# EAGLE schematic i2c_relay (EAGLE 9.6.2)
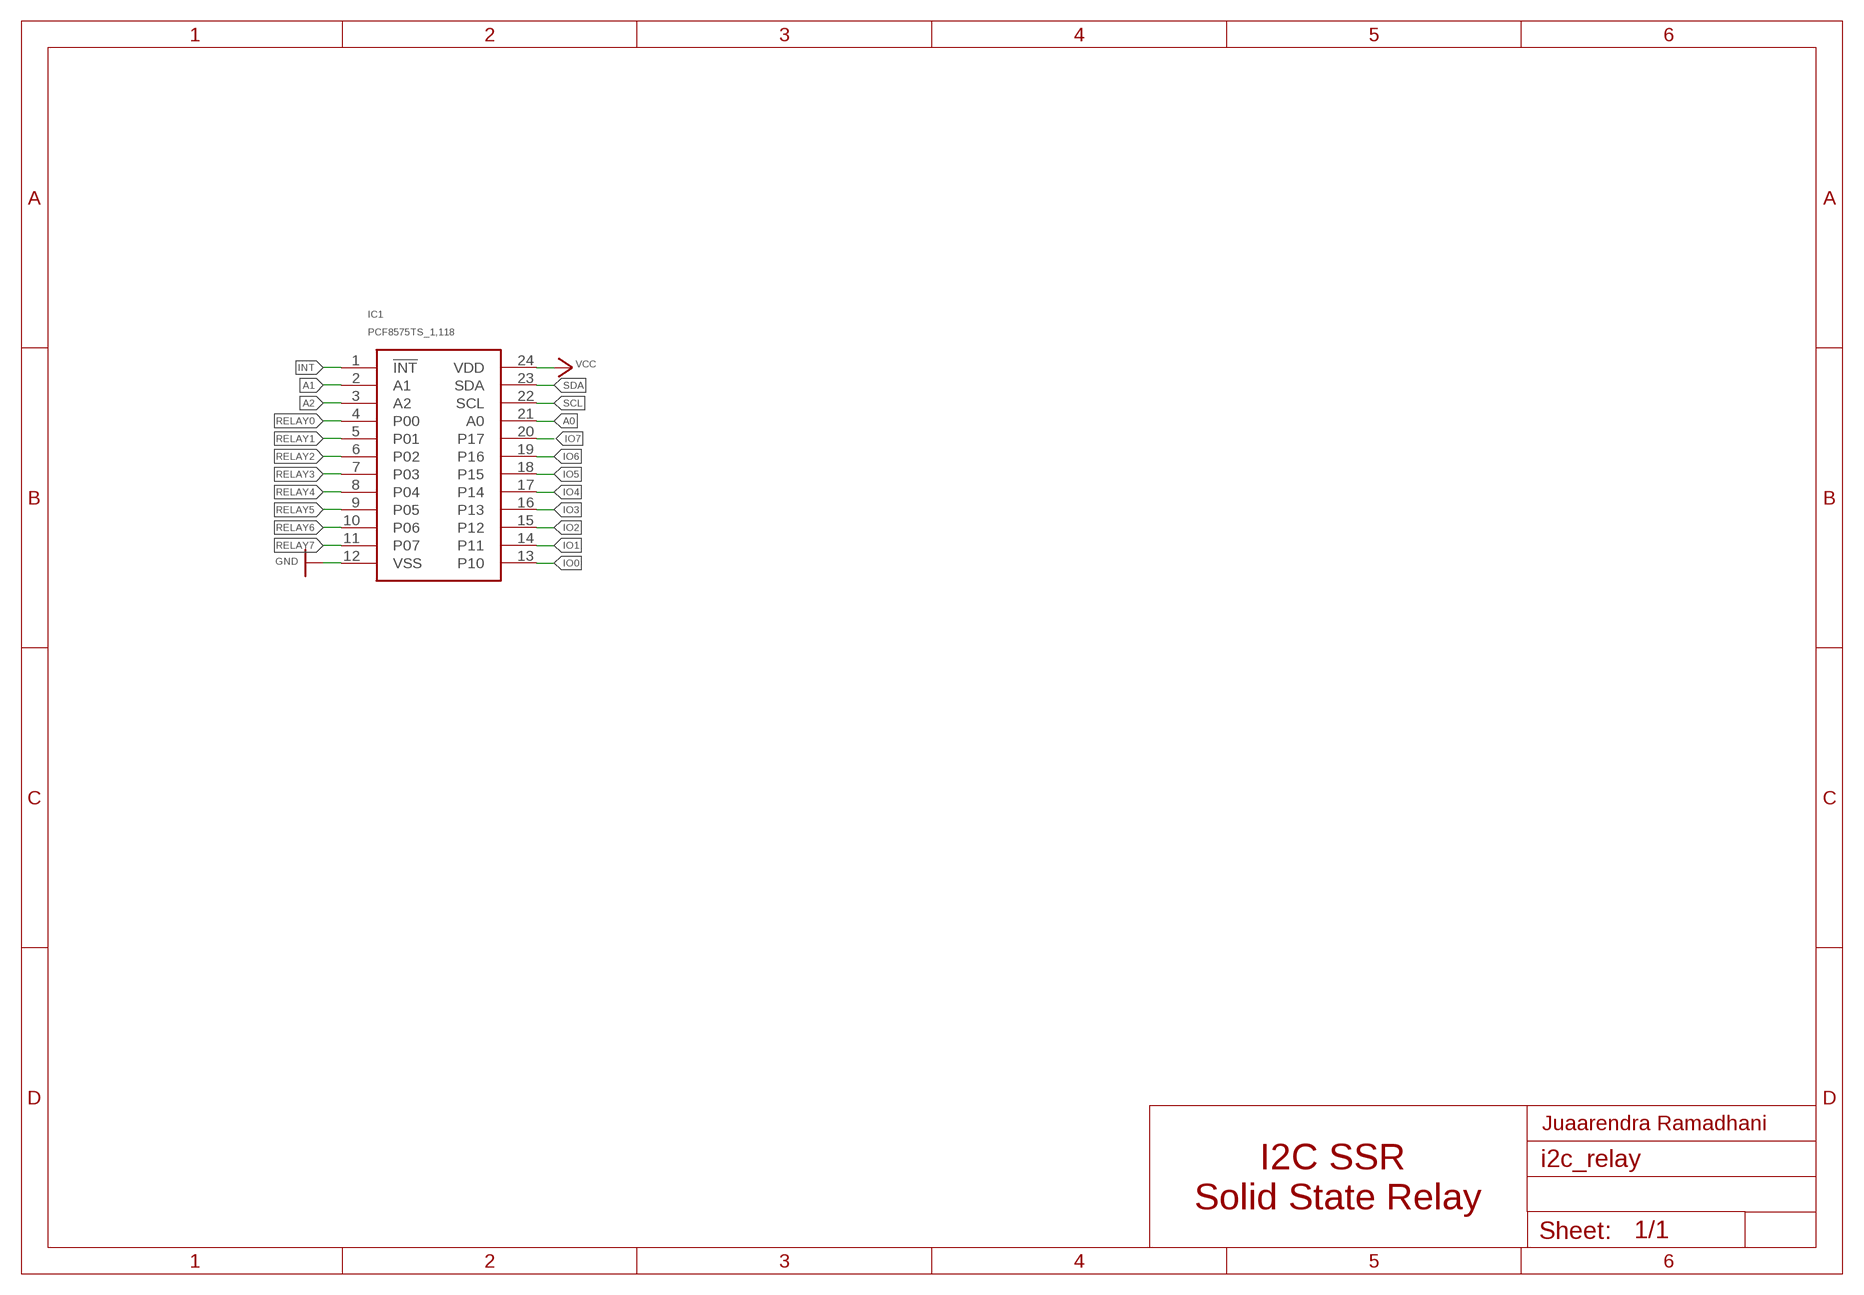
[diagram p0: schematic, sheet 1]

## Parts
IC1  PCF8575TS_1,118  [SOP65P775X200-24N]

## Nets
A0: IC1.21(A0)
A1: IC1.2(A1)
A2: IC1.3(A2)
GND: IC1.12(VSS)
INT: IC1.1(!INT)
IO0: IC1.13(P10)
IO1: IC1.14(P11)
IO2: IC1.15(P12)
IO3: IC1.16(P13)
IO4: IC1.17(P14)
IO5: IC1.18(P15)
IO6: IC1.19(P16)
IO7: IC1.20(P17)
RELAY0: IC1.4(P00)
RELAY1: IC1.5(P01)
RELAY2: IC1.6(P02)
RELAY3: IC1.7(P03)
RELAY4: IC1.8(P04)
RELAY5: IC1.9(P05)
RELAY6: IC1.10(P06)
RELAY7: IC1.11(P07)
SCL: IC1.22(SCL)
SDA: IC1.23(SDA)
VCC: IC1.24(VDD)

## Notes on the sheet
- Juaarendra Ramadhani
- I2C SSR 
  Solid State Relay

## Library data of the parts
IC1 = SamacSys_Parts:PCF8575TS_1,118: Interface - I/O Expanders Source: Datasheet <http://www.nxp.com/docs/en/data-sheet/PCF8575C.pdf>; DESCRIPTION: Interface - I/O Expanders; DIGIKEY_PARTNUMBER: 568-1079-1-ND; DIGIKEY_PRICE-STOCK: https://www.digikey.com/product-detail/en/nxp-usa-inc/PCF8575TS-1-118/568-1079-1-ND/735793; HEIGHT: 2mm; MANUFACTURER_NAME: NXP; MANUFACTURER_PART_NUMBER: PCF8575TS/1,118; MOUSER_PART_NUMBER: 771-PCF8575TSDB-T; MOUSER_PRICE-STOCK: https://www.mouser.co.uk/ProductDetail/NXP-Semiconductors/PCF8575TS-1118?qs=LOCUfHb8d9vMl26vh33NWQ%3D%3D